# Altium schematic sheet HPC_IJ.SchDoc: HPC connector ROW J and ROW K
size A4; Date: 20.05.2022; ApprovedBy: PFH; CompanyName: IAM Electronic GmbH; DrawnBy: PFH; Engineer: PFH; Revision: A; SheetNumber: 6; SheetTotal: 6; Projekt: FMC Power Module; Website: www.iamelectronic.com
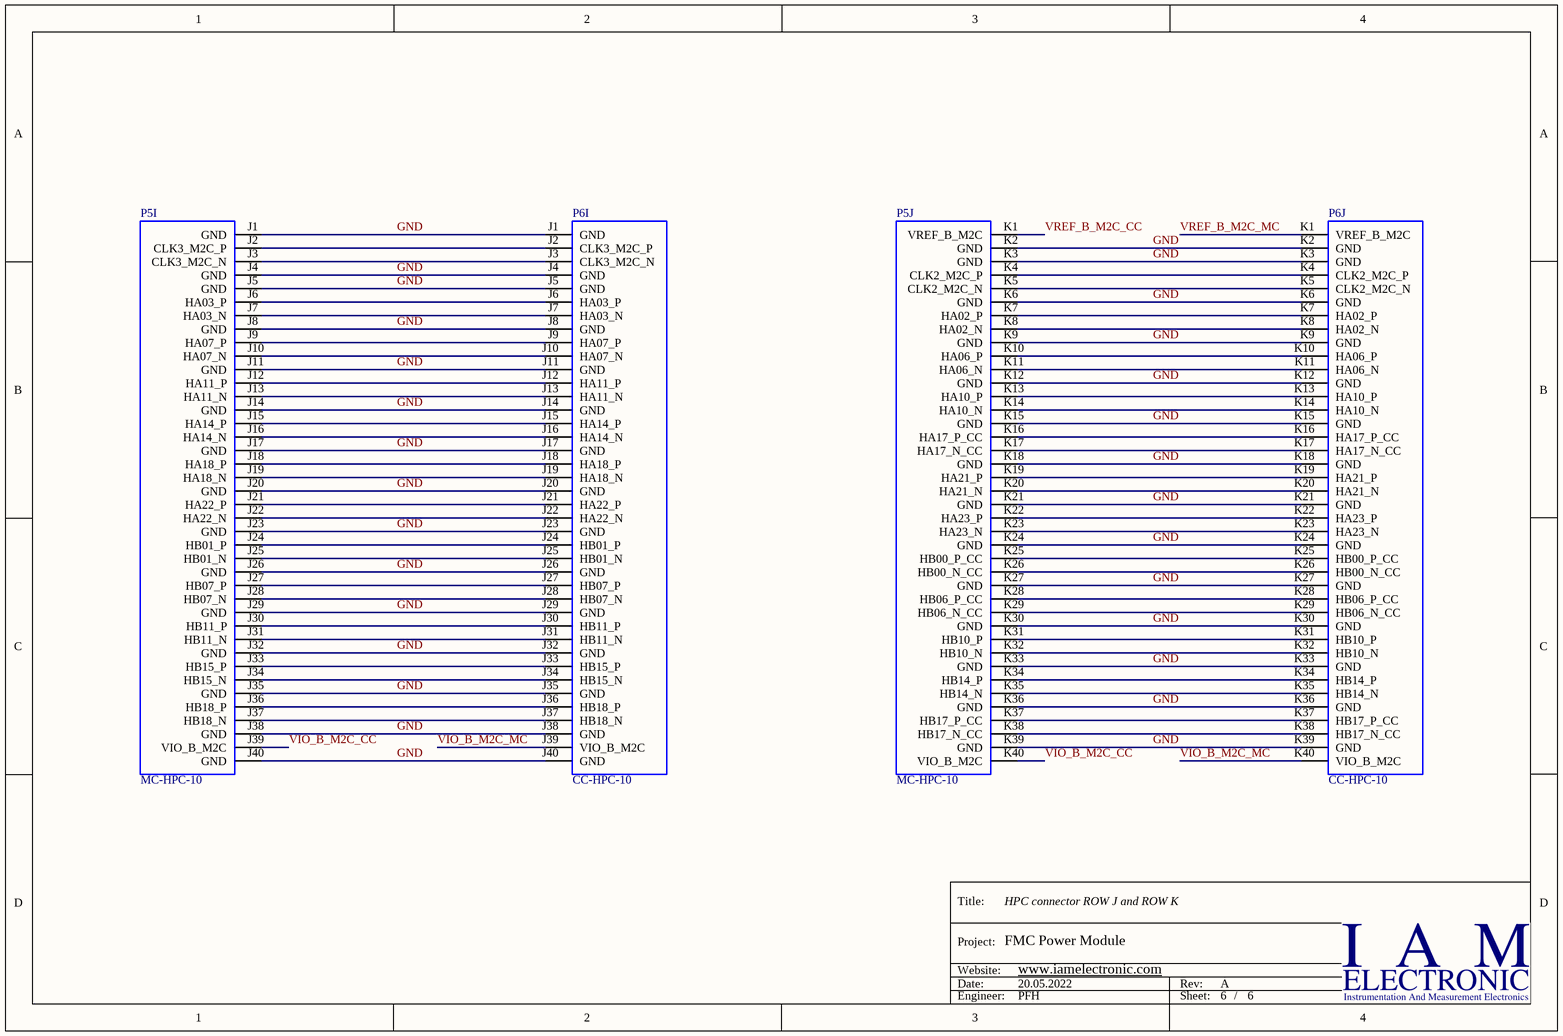
[diagram p0: HPC_IJ.SchDoc]

## Parts
P5  MC-HPC-10  [ASP-134488-01]  (parts I,J of 10)
P6  CC-HPC-10  [ASP-134486-01]  (parts I,J of 10)

## Nets
GND: P5.J1(GND) P5.J4(GND) P5.J5(GND) P5.J8(GND) P5.J11(GND) P5.J14(GND) P5.J17(GND) P5.J20(GND) P5.J23(GND) P5.J26(GND) P5.J29(GND) P5.J32(GND) P5.J35(GND) P5.J38(GND) P5.J40(GND) P5.K2(GND) P5.K3(GND) P5.K6(GND) P5.K9(GND) P5.K12(GND) P5.K15(GND) P5.K18(GND) P5.K21(GND) P5.K24(GND) P5.K27(GND) P5.K30(GND) P5.K33(GND) P5.K36(GND) P5.K39(GND) P6.J1(GND) P6.J4(GND) P6.J5(GND) P6.J8(GND) P6.J11(GND) P6.J14(GND) P6.J17(GND) P6.J20(GND) P6.J23(GND) P6.J26(GND) P6.J29(GND) P6.J32(GND) P6.J35(GND) P6.J38(GND) P6.J40(GND) P6.K2(GND) P6.K3(GND) P6.K6(GND) P6.K9(GND) P6.K12(GND) P6.K15(GND) P6.K18(GND) P6.K21(GND) P6.K24(GND) P6.K27(GND) P6.K30(GND) P6.K33(GND) P6.K36(GND) P6.K39(GND)
VIO_B_M2C_CC: P5.J39(VIO_B_M2C) P5.K40(VIO_B_M2C)
VIO_B_M2C_MC: P6.J39(VIO_B_M2C) P6.K40(VIO_B_M2C)
VREF_B_M2C_CC: P5.K1(VREF_B_M2C)
VREF_B_M2C_MC: P6.K1(VREF_B_M2C)
NetP5_J2: P5.J2(CLK3_M2C_P) P6.J2(CLK3_M2C_P)
NetP5_J3: P5.J3(CLK3_M2C_N) P6.J3(CLK3_M2C_N)
NetP5_J6: P5.J6(HA03_P) P6.J6(HA03_P)
NetP5_J7: P5.J7(HA03_N) P6.J7(HA03_N)
NetP5_J9: P5.J9(HA07_P) P6.J9(HA07_P)
NetP5_J10: P5.J10(HA07_N) P6.J10(HA07_N)
NetP5_J12: P5.J12(HA11_P) P6.J12(HA11_P)
NetP5_J13: P5.J13(HA11_N) P6.J13(HA11_N)
NetP5_J15: P5.J15(HA14_P) P6.J15(HA14_P)
NetP5_J16: P5.J16(HA14_N) P6.J16(HA14_N)
NetP5_J18: P5.J18(HA18_P) P6.J18(HA18_P)
NetP5_J19: P5.J19(HA18_N) P6.J19(HA18_N)
NetP5_J21: P5.J21(HA22_P) P6.J21(HA22_P)
NetP5_J22: P5.J22(HA22_N) P6.J22(HA22_N)
NetP5_J24: P5.J24(HB01_P) P6.J24(HB01_P)
NetP5_J25: P5.J25(HB01_N) P6.J25(HB01_N)
NetP5_J27: P5.J27(HB07_P) P6.J27(HB07_P)
NetP5_J28: P5.J28(HB07_N) P6.J28(HB07_N)
NetP5_J30: P5.J30(HB11_P) P6.J30(HB11_P)
NetP5_J31: P5.J31(HB11_N) P6.J31(HB11_N)
NetP5_J33: P5.J33(HB15_P) P6.J33(HB15_P)
NetP5_J34: P5.J34(HB15_N) P6.J34(HB15_N)
NetP5_J36: P5.J36(HB18_P) P6.J36(HB18_P)
NetP5_J37: P5.J37(HB18_N) P6.J37(HB18_N)
NetP5_K4: P5.K4(CLK2_M2C_P) P6.K4(CLK2_M2C_P)
NetP5_K5: P5.K5(CLK2_M2C_N) P6.K5(CLK2_M2C_N)
NetP5_K7: P5.K7(HA02_P) P6.K7(HA02_P)
NetP5_K8: P5.K8(HA02_N) P6.K8(HA02_N)
NetP5_K10: P5.K10(HA06_P) P6.K10(HA06_P)
NetP5_K11: P5.K11(HA06_N) P6.K11(HA06_N)
NetP5_K13: P5.K13(HA10_P) P6.K13(HA10_P)
NetP5_K14: P5.K14(HA10_N) P6.K14(HA10_N)
NetP5_K16: P5.K16(HA17_P_CC) P6.K16(HA17_P_CC)
NetP5_K17: P5.K17(HA17_N_CC) P6.K17(HA17_N_CC)
NetP5_K19: P5.K19(HA21_P) P6.K19(HA21_P)
NetP5_K20: P5.K20(HA21_N) P6.K20(HA21_N)
NetP5_K22: P5.K22(HA23_P) P6.K22(HA23_P)
NetP5_K23: P5.K23(HA23_N) P6.K23(HA23_N)
NetP5_K25: P5.K25(HB00_P_CC) P6.K25(HB00_P_CC)
NetP5_K26: P5.K26(HB00_N_CC) P6.K26(HB00_N_CC)
NetP5_K28: P5.K28(HB06_P_CC) P6.K28(HB06_P_CC)
NetP5_K29: P5.K29(HB06_N_CC) P6.K29(HB06_N_CC)
NetP5_K31: P5.K31(HB10_P) P6.K31(HB10_P)
NetP5_K32: P5.K32(HB10_N) P6.K32(HB10_N)
NetP5_K34: P5.K34(HB14_P) P6.K34(HB14_P)
NetP5_K35: P5.K35(HB14_N) P6.K35(HB14_N)
NetP5_K37: P5.K37(HB17_P_CC) P6.K37(HB17_P_CC)
NetP5_K38: P5.K38(HB17_N_CC) P6.K38(HB17_N_CC)

## Notes on the sheet
- Title:
- Project:
- Date:
- Website:
- Rev:
- Engineer:
- Sheet:
- /

## Library data of the parts
P5 = MC-HPC-10: MC-HPC-10, FMC High-pin count connector, lead free, 400 I/Os, male, 10 mm mated stack height; Manufacturer: Samtec; Manufacturer Ref: SEAM-40-03.5-S-10-2-A-K-TR-VITA57.0; Pitch: 1.27 mm; Mated Stack Height: 10 mm; Solder Type: Lead-Free; Number I/O: 400; PartName: ASP-134488-01; Part: ASP-134488-01; Vita PartNumber: MC-HPC-10; Pin Count: High; Gender: male; Supplier 1: Digi-Key; Supplier Part Number 1: SAM8730-ND
P6 = CC-HPC-10: CC-HPC-10, FMC High-pin count connector, lead free, 400 I/Os, female, 10 mm mated stack height; Manufacturer: Samtec; Manufacturer Ref: SEAF-40-06.5-10-A; Pitch: 1.27 mm; Mated Stack Height: 10 mm; Solder Type: Lead-Free; Number I/O: 400; PartName: ASP-134486-01; Part: ASP-134486-01; Vita PartNumber: CC-HPC-10; Pin Count: High; Gender: female; Supplier 1: Digi-Key; Supplier Part Number 1: SAM8728-ND